# EAGLE schematic sensbase (EAGLE 6.3)
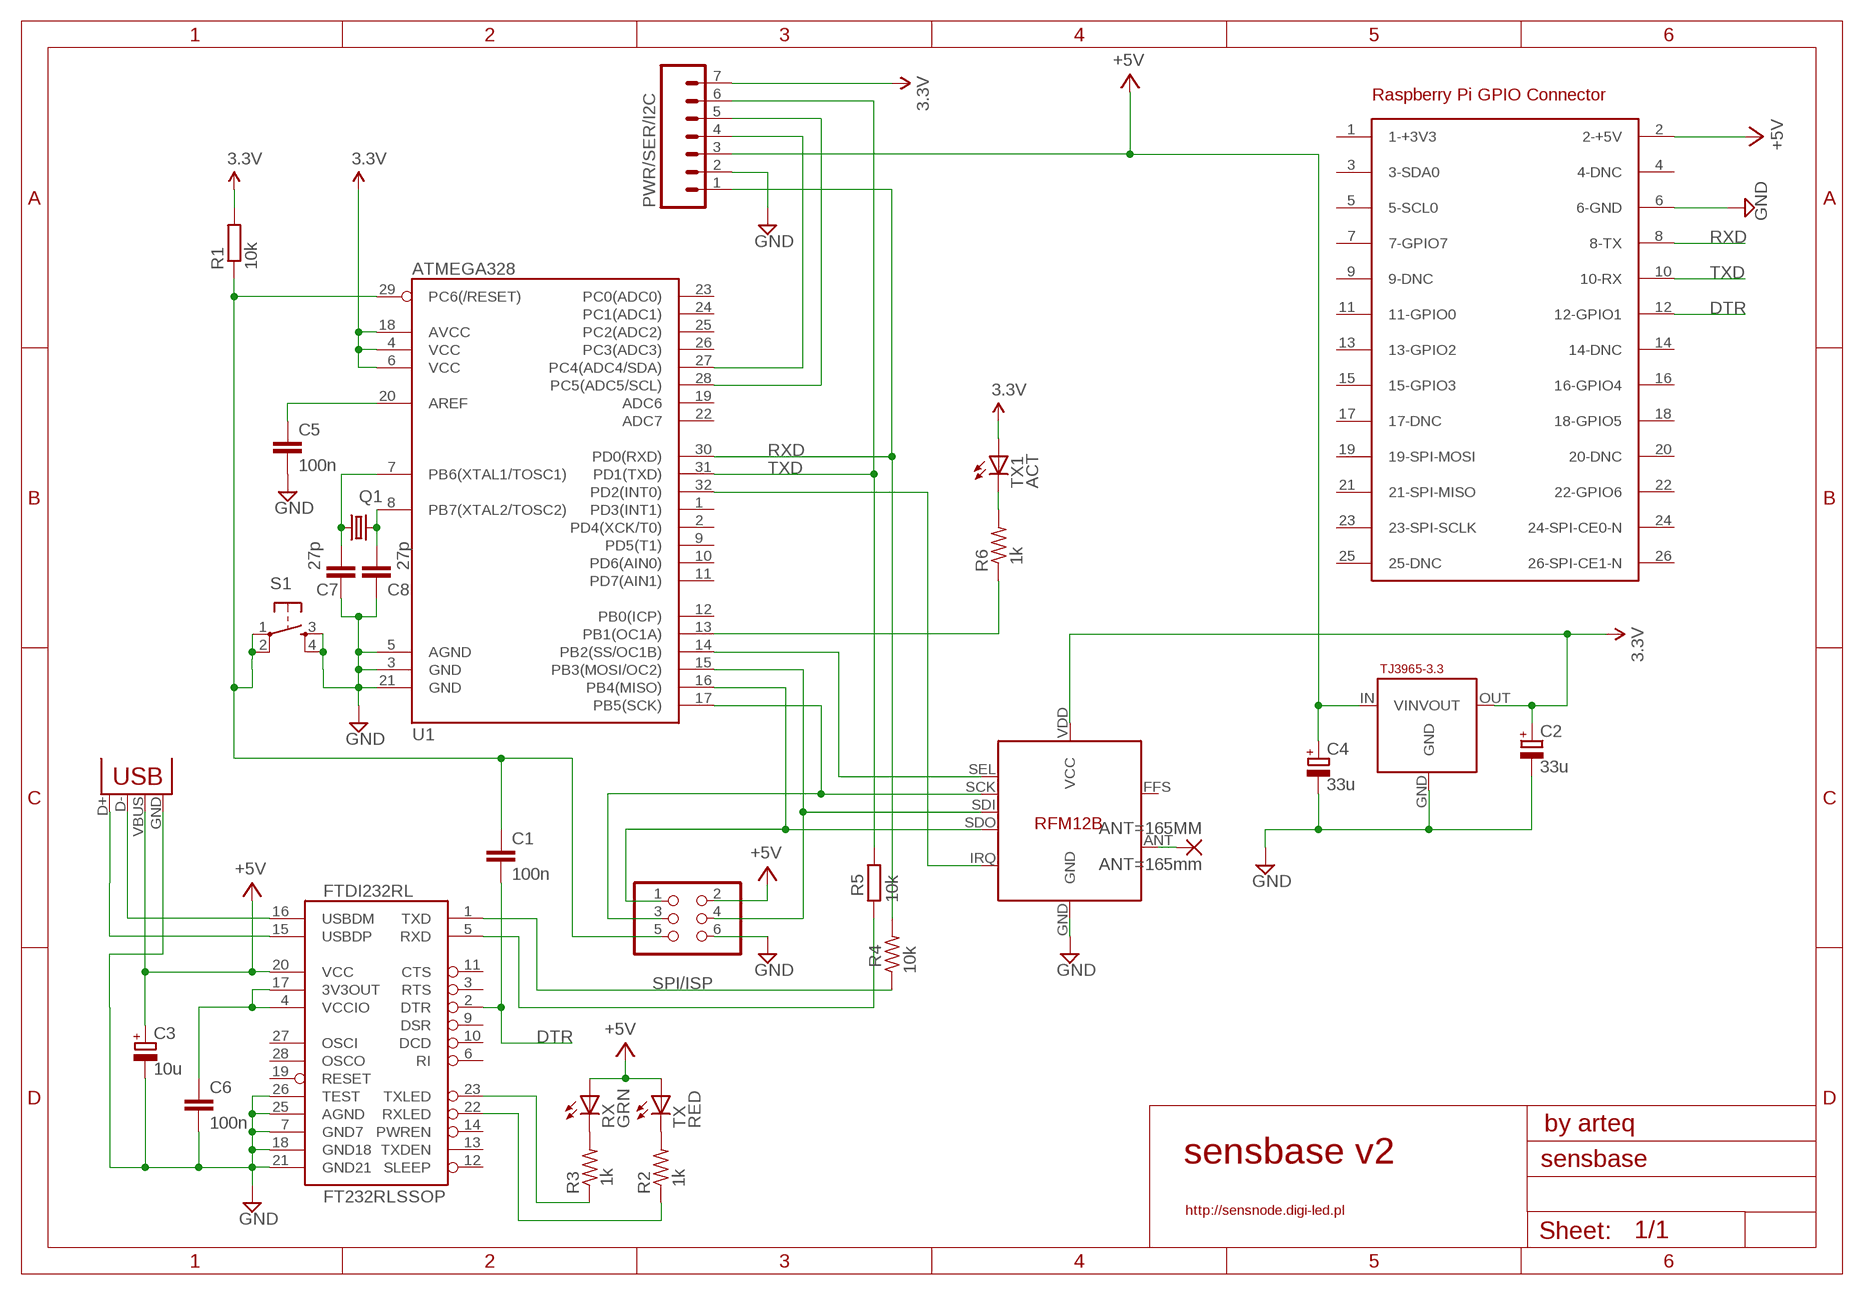
[diagram p0: schematic, sheet 1]

## Parts
3.3  TJ3965-3.3  [SOT223]
ANT=165MM  ANT=165mm  1,6/0,9  [1,6/0,9]
C1  100n  C-EUC0805  [C0805]
C2  33u  CPOL-EUSMCB  [SMC_B]
C3  10u  CPOL-EUSMCA  [SMC_A]
C4  33u  CPOL-EUSMCB  [SMC_B]
C5  100n  C-EUC0805  [C0805]
C6  100n  C-EUC0805  [C0805]
C7  27p  C-EUC0805  [C0805]
C8  27p  C-EUC0805  [C0805]
FTDI232RL  FT232RLSSOP  [SSOP28DB]
PWR/SER/I2C  PSI  M07  [1X07]
Q1  CRYSTALHC49UP  [HC49UP]
R1  10k  R-EU_R0805  [R0805]
R2  1k  R-US_R0805  [R0805@1]
R3  1k  R-US_R0805  [R0805@1]
R4  10k  R-US_R0805  [R0805@1]
R5  10k  R-EU_R0805  [R0805]
R6  1k  R-US_R0805  [R0805@1]
RF433  RFM12B  [RFM12B]
RX  GRN  LEDCHIP-LED0805  [CHIP-LED0805]
S1  TAC_SWITCHSMD  [TACTILE_SWITCH_SMD]
SV7  SPI/ISP  PINHD-2X3  [2X03]
TX  RED  LEDCHIP-LED0805  [CHIP-LED0805]
TX1  ACT  LEDCHIP-LED0805  [CHIP-LED0805]
U1  ATMEGA328  ATMEGA168  [TQFP32-08]
U$2  RASPBERRY-PI  [RASPBERRY-PI]
X1  USBSMD  [USB-MINIB]

## Nets
+5V [power]: 3.3.IN(VIN) C3.+ C4.+ FTDI232RL.20(VCC) PWR/SER/I2C.3 RX.A SV7.2 TX.A U$2.2(2-+5V) X1.VBUS
DTR: C1.2 FTDI232RL.2(DTR) U$2.12(12-GPIO1)
GND [power]: 3.3.GND C2.- C3.- C4.- C5.2 C6.2 C7.2 C8.2 FTDI232RL.7(GND7) FTDI232RL.18(GND18) FTDI232RL.21(GND21) FTDI232RL.25(AGND) FTDI232RL.26(TEST) PWR/SER/I2C.2 RF433.GND S1.3 S1.4 SV7.6 U1.3(GND) U1.5(AGND) U1.21(GND) U$2.6(6-GND) X1.GND
N$1: C7.1 Q1.1 U1.7(PB6(XTAL1/TOSC1))
N$2: RF433.SDO SV7.1 U1.16(PB4(MISO))
N$3: RF433.SDI SV7.4 U1.15(PB3(MOSI/OC2))
N$4: RF433.SEL U1.14(PB2(SS/OC1B))
N$5: RF433.SCK SV7.3 U1.17(PB5(SCK))
N$6: R6.1 U1.13(PB1(OC1A))
N$7: RF433.IRQ U1.32(PD2(INT0))
N$9: C1.1 R1.1 S1.1 S1.2 SV7.5 U1.29(PC6(/RESET))
N$12: C5.1 U1.20(AREF)
N$14: R6.2 TX1.C
N$15: FTDI232RL.16(USBDM) X1.D-
N$16: FTDI232RL.15(USBDP) X1.D+
N$17: FTDI232RL.1(TXD) R4.1
N$18: ANT=165MM.1(P) RF433.ANT
N$20 [power]: C6.1 FTDI232RL.4(VCCIO) FTDI232RL.17(3V3OUT)
N$21: C8.1 Q1.2 U1.8(PB7(XTAL2/TOSC2))
N$24: PWR/SER/I2C.5 U1.28(PC5(ADC5/SCL))
N$25: PWR/SER/I2C.4 U1.27(PC4(ADC4/SDA))
N$29: R2.2 TX.C
N$30: R3.2 RX.C
N$32: FTDI232RL.23(TXLED) R3.1
N$33: FTDI232RL.22(RXLED) R2.1
RXD: PWR/SER/I2C.1 R4.2 U1.30(PD0(RXD)) U$2.8(8-TX)
TXD: PWR/SER/I2C.6 R5.2 U1.31(PD1(TXD)) U$2.10(10-RX)
TXD1: FTDI232RL.5(RXD) R5.1
VCC [power]: 3.3.OUT(VOUT) C2.+ PWR/SER/I2C.7 R1.2 RF433.VDD(VCC) TX1.A U1.4(VCC) U1.6(VCC) U1.18(AVCC) ; supply symbol labelled 3.3V
Unconnected: FTDI232RL.3(RTS) FTDI232RL.6(RI) FTDI232RL.9(DSR) FTDI232RL.10(DCD) FTDI232RL.11(CTS) FTDI232RL.12(SLEEP) FTDI232RL.13(TXDEN) FTDI232RL.14(PWREN) FTDI232RL.19(RESET) FTDI232RL.27(OSCI) FTDI232RL.28(OSCO) RF433.FFS U1.1(PD3(INT1)) U1.2(PD4(XCK/T0)) U1.9(PD5(T1)) U1.10(PD6(AIN0)) U1.11(PD7(AIN1)) U1.12(PB0(ICP)) U1.19(ADC6) U1.22(ADC7) U1.23(PC0(ADC0)) U1.24(PC1(ADC1)) U1.25(PC2(ADC2)) U1.26(PC3(ADC3)) U$2.1(1-+3V3) U$2.3(3-SDA0) U$2.4(4-DNC) U$2.5(5-SCL0) U$2.7(7-GPIO7) U$2.9(9-DNC) U$2.11(11-GPIO0) U$2.13(13-GPIO2) U$2.14(14-DNC) U$2.15(15-GPIO3) U$2.16(16-GPIO4) U$2.17(17-DNC) U$2.18(18-GPIO5) U$2.19(19-SPI-MOSI) U$2.20(20-DNC) U$2.21(21-SPI-MISO) U$2.22(22-GPIO6) U$2.23(23-SPI-SCLK) U$2.24(24-SPI-CE0-N) U$2.25(25-DNC) U$2.26(26-SPI-CE1-N)

## Notes on the sheet
- Raspberry Pi GPIO Connector
- by arteq
- sensbase v2
- http://sensnode.digi-led.pl

## Library data of the parts
3.3 = artek:TJ3965-3.3: Stabilizator TJ3965S-3.3 firmy HTC
ANT=165MM = wirepad:1,6/0,9: THROUGH-HOLE PAD
C1 C5-C8 = resistor:C-EU: CAPACITOR, European symbol
C2-C4 = resistor:CPOL-EU: POLARIZED CAPACITOR, European symbol
FTDI232RL = SparkFun:FT232RL: USB UART FT232RL 4th Generation USB UART (USB <-> Serial) Controller. Spark Fun Electronics SKU : COM-00650
PWR/SER/I2C = SparkFun:M07: Header 7 Standard 7-pin 0.1" header. Use with straight break away headers (SKU : PRT-00116), right angle break away headers (PRT-00553), swiss pins (PRT-00743), machine pins (PRT-00117), and female headers (PRT-00115). NOTES ON THE VARIANTS LOCK and LOCK_LONGPADS... This footprint was designed to help hold the alignment of a through-hole component (i.e. 7-pin header) while soldering it into place. You may notice that each hole has been shifted either up or down by 0.005 of an inch from it's more standard position (which is usually a perfectly straight line). This slight alteration caused the pins (the squares in the middle) to touch the edges of the holes. Because they are alternating, it causes a "brace" to hold the header in place. 0.005 has proven to be the perfect amount of "off-center" position when using our standard breakaway headers. Although looks a little odd when you look at the bare footprint, once you have a header in there, the alteration is very hard to notice. Also, if you push a header all the way into place, it is covered up entirely on the bottom side. This idea of altering the position of holes to aid alignment will be further integrated into the Sparkfun Library for other footprints. It can help hold any component with 3 or more connection pins.
Q1 = crystal:CRYSTAL: CRYSTAL
R1 R5 = resistor:R-EU_: RESISTOR, European symbol
R2-R4 R6 = rcl:R-US_: RESISTOR, American symbol
RF433 = JeeLabs:RFM12B
RX TX TX1 = adafruit:LED: LED OSRAM: - CHIPLED LG R971, LG N971, LY N971, LG Q971, LY Q971, LO R971, LY R971 LH N974, LH R974 LS Q976, LO Q976, LY Q976 LO Q996 - Hyper CHIPLED LW Q18S LB Q993, LB Q99A, LB R99A - SideLED LS A670, LO A670, LY A670, LG A670, LP A670 LB A673, LV A673, LT A673, LW A673 LH A674 LY A675 LS A676, LA A676, LO A676, LY A676, LW A676 LS A679, LY A679, LG A679 - Hyper Micro SIDELED® LS Y876, LA Y876, LO Y876, LY Y876 LT Y87S - SmartLED LW L88C, LW L88S LB L89C, LB L89S, LG L890 LS L89K, LO L89K, LY L89K LS L896, LA L896, LO L896, LY L896 - TOPLED LS T670, LO T670, LY T670, LG T670, LP T670 LSG T670, LSP T670, LSY T670, LOP T670, LYG T670 LG T671, LOG T671, LSG T671 LB T673, LV T673, LT T673, LW T673 LH T674 LS T676, LA T676, LO T676, LY T676, LB T676, LH T676, LSB T676, LW T676 LB T67C, LV T67C, LT T67C, LS T67K, LO T67K, LY T67K, LW E67C LS E67B, LA E67B, LO E67B, LY E67B, LB E67C, LV E67C, LT E67C LW T67C LS T679, LY T679, LG T679 LS T770, LO T770, LY T770, LG T770, LP T770 LB T773, LV T773, LT T773, LW T773 LH T774 LS E675, LA E675, LY E675, LS T675 LS T776, LA T776, LO T776, LY T776, LB T776 LHGB T686 LT T68C, LB T68C - Hyper Mini TOPLED® LB M676 - Mini TOPLED Santana® LG M470 LS M47K, LO M47K, LY M47K Source: http://www.osram.convergy.de/
S1 = SparkFun:TAC_SWITCH: Momentary Switch Button commonly used for reset or general input. Spark Fun Electronics SKU : COM-00097
SV7 = pinhead:PINHD-2X3: PIN HEADER
U1 = SparkFun:ATMEGA168
U$2 = RaspberryPi:RASPBERRY-PI: Raspberry Pi Board <http://www.raspberrypi.org/> Jacques Lagnel V1.0 (beta) 2012 Board dimension: Forum 3D model <http://www.raspberrypi.org/forum/general-discussion/mechanical-profile-3d-models?value=3d%20model&type=1&include=1&search=1&ret=all> The GPIO Connector (P1): http://elinux.org/RPi_Low-level_peripherals
X1 = SparkFun:USB: USB Connectors USB-B-PTH is fully proven SKU : PRT-00139 USB-miniB is fully proven SKU : PRT-00587 USB-A-PCB is untested. USB-A-H is throughly reviewed, but untested. Spark Fun Electronics SKU : PRT-00437 USB-B-SMT is throughly reviewed, but untested. Needs silkscreen touching up. USB-A-S has not been used/tested USB-MB-H has not been used/tested

## Net classes
0 default: width 0.2 mm
1 power: width 0.305 mm